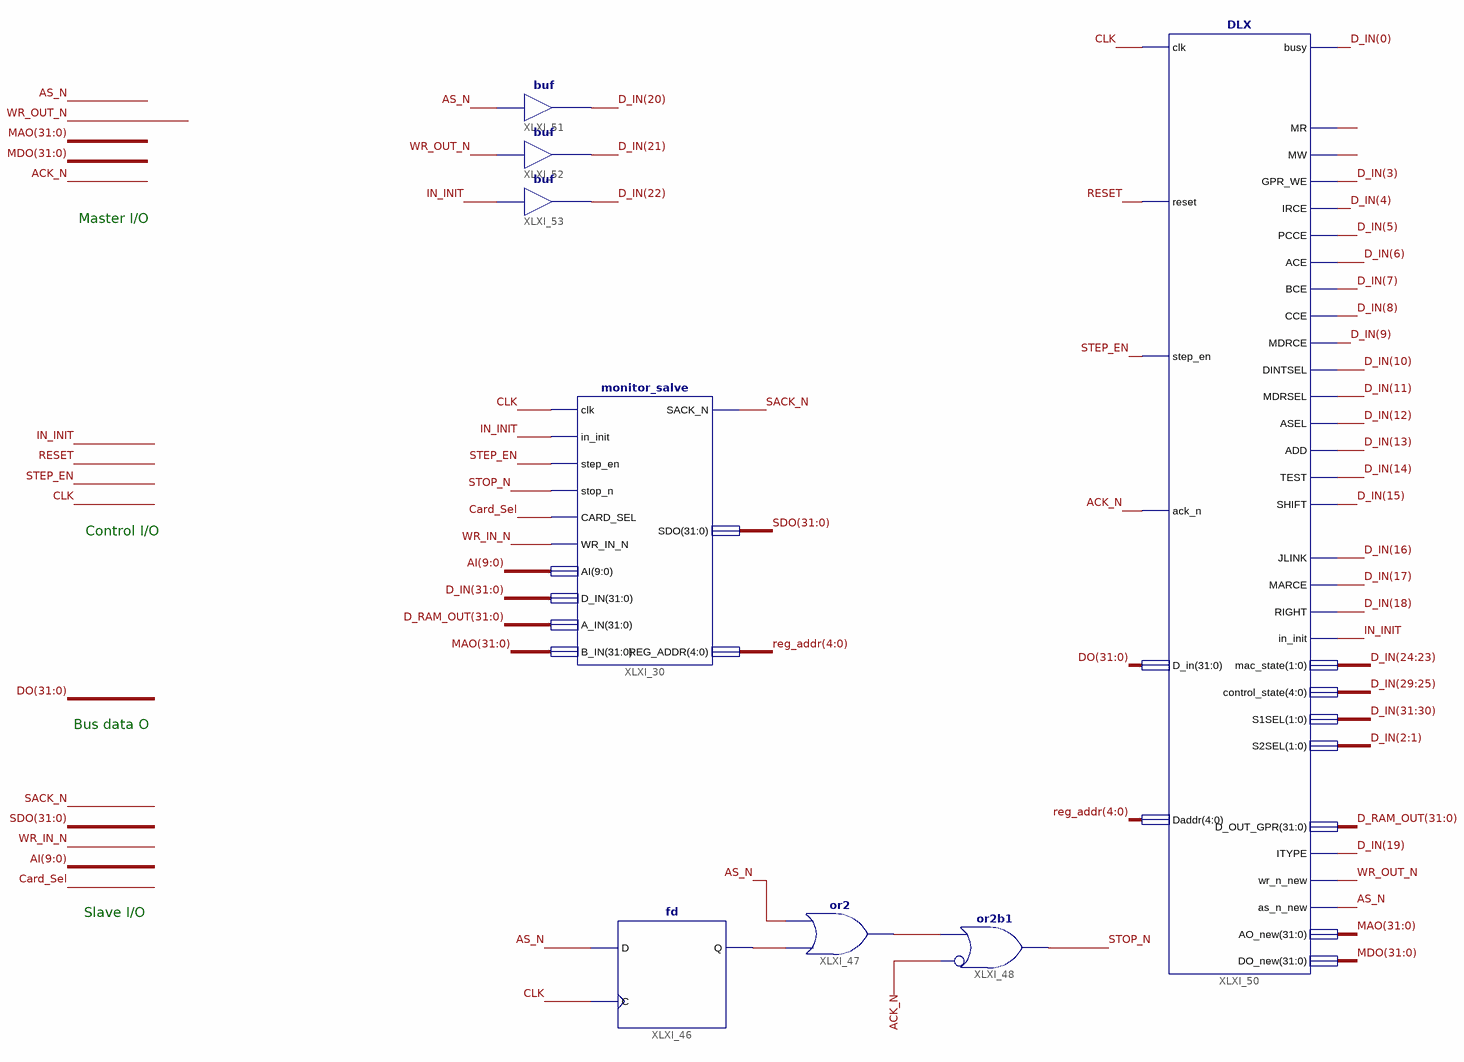
[diagram p0: schematic sheet 1]
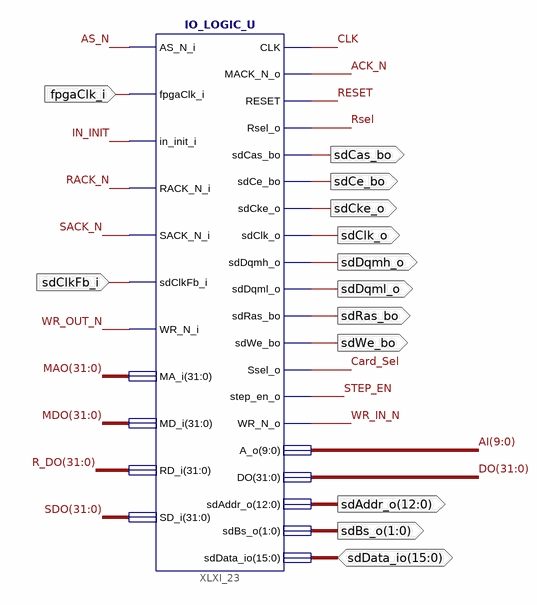
[diagram p1: schematic sheet 2]
// Xilinx ISE schematic Top_Level.sch (spartan6) as structural Verilog: 9 symbols, 13 ports
module Top_Level (
  input  fpgaClk_i,
  input  sdClkFb_i,
  inout  [15:0] sdData_io,
  output sdClk_o,
  output [1:0] sdBs_o,
  output sdDqml_o,
  output sdDqmh_o,
  output sdWe_bo,
  output sdCas_bo,
  output sdRas_bo,
  output sdCe_bo,
  output sdCke_o,
  output [12:0] sdAddr_o
);

  wire ACK_N, AS_N, Card_Sel, CLK, IN_INIT, RACK_N, RESET, Rsel, SACK_N, STEP_EN, STOP_N, WR_IN_N, WR_OUT_N,
       XLXN_1, XLXN_2, XLXN_76, XLXN_77;
  wire [4:0] reg_addr;
  wire [9:0] AI;
  wire [31:0] D_IN, D_RAM_OUT, DO, MAO, MDO, R_DO, SDO;

  IO_LOGIC_U XLXI_23 (
    .AS_N_i(AS_N), .fpgaClk_i(fpgaClk_i), .in_init_i(IN_INIT), .RACK_N_i(RACK_N), .SACK_N_i(SACK_N),
    .sdClkFb_i(sdClkFb_i), .WR_N_i(WR_OUT_N), .MA_i(MAO), .MD_i(MDO), .RD_i(R_DO), .SD_i(SDO), .CLK(CLK),
    .MACK_N_o(ACK_N), .RESET(RESET), .Rsel_o(Rsel), .sdCas_bo(sdCas_bo), .sdCe_bo(sdCe_bo),
    .sdCke_o(sdCke_o), .sdClk_o(sdClk_o), .sdDqmh_o(sdDqmh_o), .sdDqml_o(sdDqml_o), .sdRas_bo(sdRas_bo),
    .sdWe_bo(sdWe_bo), .Ssel_o(Card_Sel), .step_en_o(STEP_EN), .WR_N_o(WR_IN_N), .A_o(AI), .DO(DO),
    .sdAddr_o(sdAddr_o), .sdBs_o(sdBs_o), .sdData_io(sdData_io));
  monitor_salve XLXI_30 (
    .clk(CLK), .in_init(IN_INIT), .step_en(STEP_EN), .stop_n(STOP_N), .CARD_SEL(Card_Sel), .WR_IN_N(WR_IN_N),
    .AI(AI), .D_IN(D_IN), .A_IN(D_RAM_OUT), .B_IN(MAO), .SACK_N(SACK_N), .SDO(SDO), .REG_ADDR(reg_addr));
  fd XLXI_46 (.C(CLK), .D(AS_N), .Q(XLXN_1));
  or XLXI_47 (XLXN_2, XLXN_1, AS_N);
  or XLXI_48 (STOP_N, ~ACK_N, XLXN_2);  // or2b1
  DLX XLXI_50 (
    .clk(CLK), .reset(RESET), .step_en(STEP_EN), .ack_n(ACK_N), .D_in(DO), .Daddr(reg_addr), .busy(D_IN[0]),
    .MR(XLXN_76), .MW(XLXN_77), .GPR_WE(D_IN[3]), .IRCE(D_IN[4]), .PCCE(D_IN[5]), .ACE(D_IN[6]),
    .BCE(D_IN[7]), .CCE(D_IN[8]), .MDRCE(D_IN[9]), .DINTSEL(D_IN[10]), .MDRSEL(D_IN[11]), .ASEL(D_IN[12]),
    .ADD(D_IN[13]), .TEST(D_IN[14]), .SHIFT(D_IN[15]), .ITYPE(D_IN[19]), .JLINK(D_IN[16]), .MARCE(D_IN[17]),
    .RIGHT(D_IN[18]), .in_init(IN_INIT), .mac_state(D_IN[24:23]), .control_state(D_IN[29:25]),
    .S1SEL(D_IN[31:30]), .S2SEL(D_IN[2:1]), .D_OUT_GPR(D_RAM_OUT), .wr_n_new(WR_OUT_N), .as_n_new(AS_N),
    .AO_new(MAO), .DO_new(MDO));
  buf XLXI_51 (D_IN[20], AS_N);
  buf XLXI_52 (D_IN[21], WR_OUT_N);
  buf XLXI_53 (D_IN[22], IN_INIT);

  // Notes on the sheet:
  //   Master I/O
  //   Control I/O
  //   Bus data O
  //   Slave I/O
endmodule
